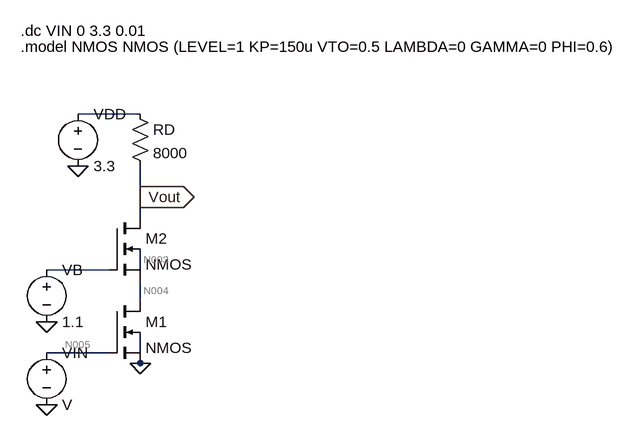
[diagram p0: schematic E3a.asc]
E3a.asc, the LTspice schematic file:
Version 4
SHEET 1 880 680
WIRE 96 -256 0 -256
WIRE 96 -128 96 -176
WIRE 96 -96 96 -128
WIRE 48 -16 -48 -16
WIRE 96 -16 96 -48
WIRE 96 32 96 0
WIRE 48 112 -48 112
WIRE 96 112 96 80
WIRE 96 128 96 128
FLAG 96 128 0
FLAG -48 64 0
FLAG -48 192 0
FLAG 0 -176 0
FLAG 96 -128 Vout
IOPIN 96 -128 Out
SYMBOL nmos4 48 32 R0
SYMATTR InstName M1
SYMATTR Value2 l=0.18u w=18u
SYMBOL nmos4 48 -96 R0
SYMATTR InstName M2
SYMATTR Value2 l=0.36u w=18u
SYMBOL res 80 -272 R0
SYMATTR InstName RD
SYMATTR Value 8000
SYMBOL voltage 0 -272 R0
WINDOW 123 0 0 Left 0
WINDOW 39 0 0 Left 0
SYMATTR InstName VDD
SYMATTR Value 3.3
SYMBOL voltage -48 -32 R0
WINDOW 123 0 0 Left 0
WINDOW 39 0 0 Left 0
SYMATTR InstName VB
SYMATTR Value 1.1
SYMBOL voltage -48 96 R0
SYMATTR InstName VIN
TEXT -88 -384 Left 2 !.dc VIN 0 3.3 0.01
TEXT -88 -360 Left 2 !.model NMOS NMOS (LEVEL=1 KP=150u VTO=0.5 LAMBDA=0 GAMMA=0 PHI=0.6)

The netlist it stands for:
* E3a.asc
M1 N004 N005 0 N006 NMOS l=0.18u w=18u
M2 Vout N002 N004 N003 NMOS l=0.36u w=18u
RD N001 Vout 8000
VDD N001 0 3.3
VB N002 0 1.1
VIN N005 0 V
.model NMOS NMOS
.model PMOS PMOS
.lib standard.mos
.dc VIN 0 3.3 0.01
.model NMOS NMOS (LEVEL=1 KP=150u VTO=0.5 LAMBDA=0 GAMMA=0 PHI=0.6)
.backanno
.end

* Results of the author's LTspice run, read from the files saved beside the schematic
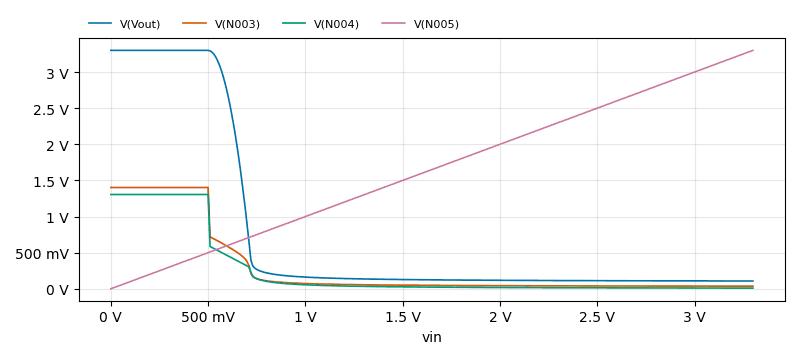
[diagram p1: DC transfer characteristic of E3a.asc, plotted from the saved traces]
* DC transfer characteristic, 1 run:
*   V(Vout): 3.3 V at vin=0 V, 107.8 mV at vin=3.3 V, min 107.8 mV, max 3.3 V
*   V(N003): 1.402 V at vin=0 V, 36.21 mV at vin=3.3 V, min 36.21 mV, max 1.402 V
*   V(N004): 1.305 V at vin=0 V, 9.517 mV at vin=3.3 V, min 9.517 mV, max 1.305 V
*   V(N005): 0 V at vin=0 V, 3.3 V at vin=3.3 V, min 0 V, max 3.3 V